# EAGLE schematic eDNA-SingleBoard-V3 (EAGLE 9.6.2)

## Sheet 1 of 2: Logic + Sensor
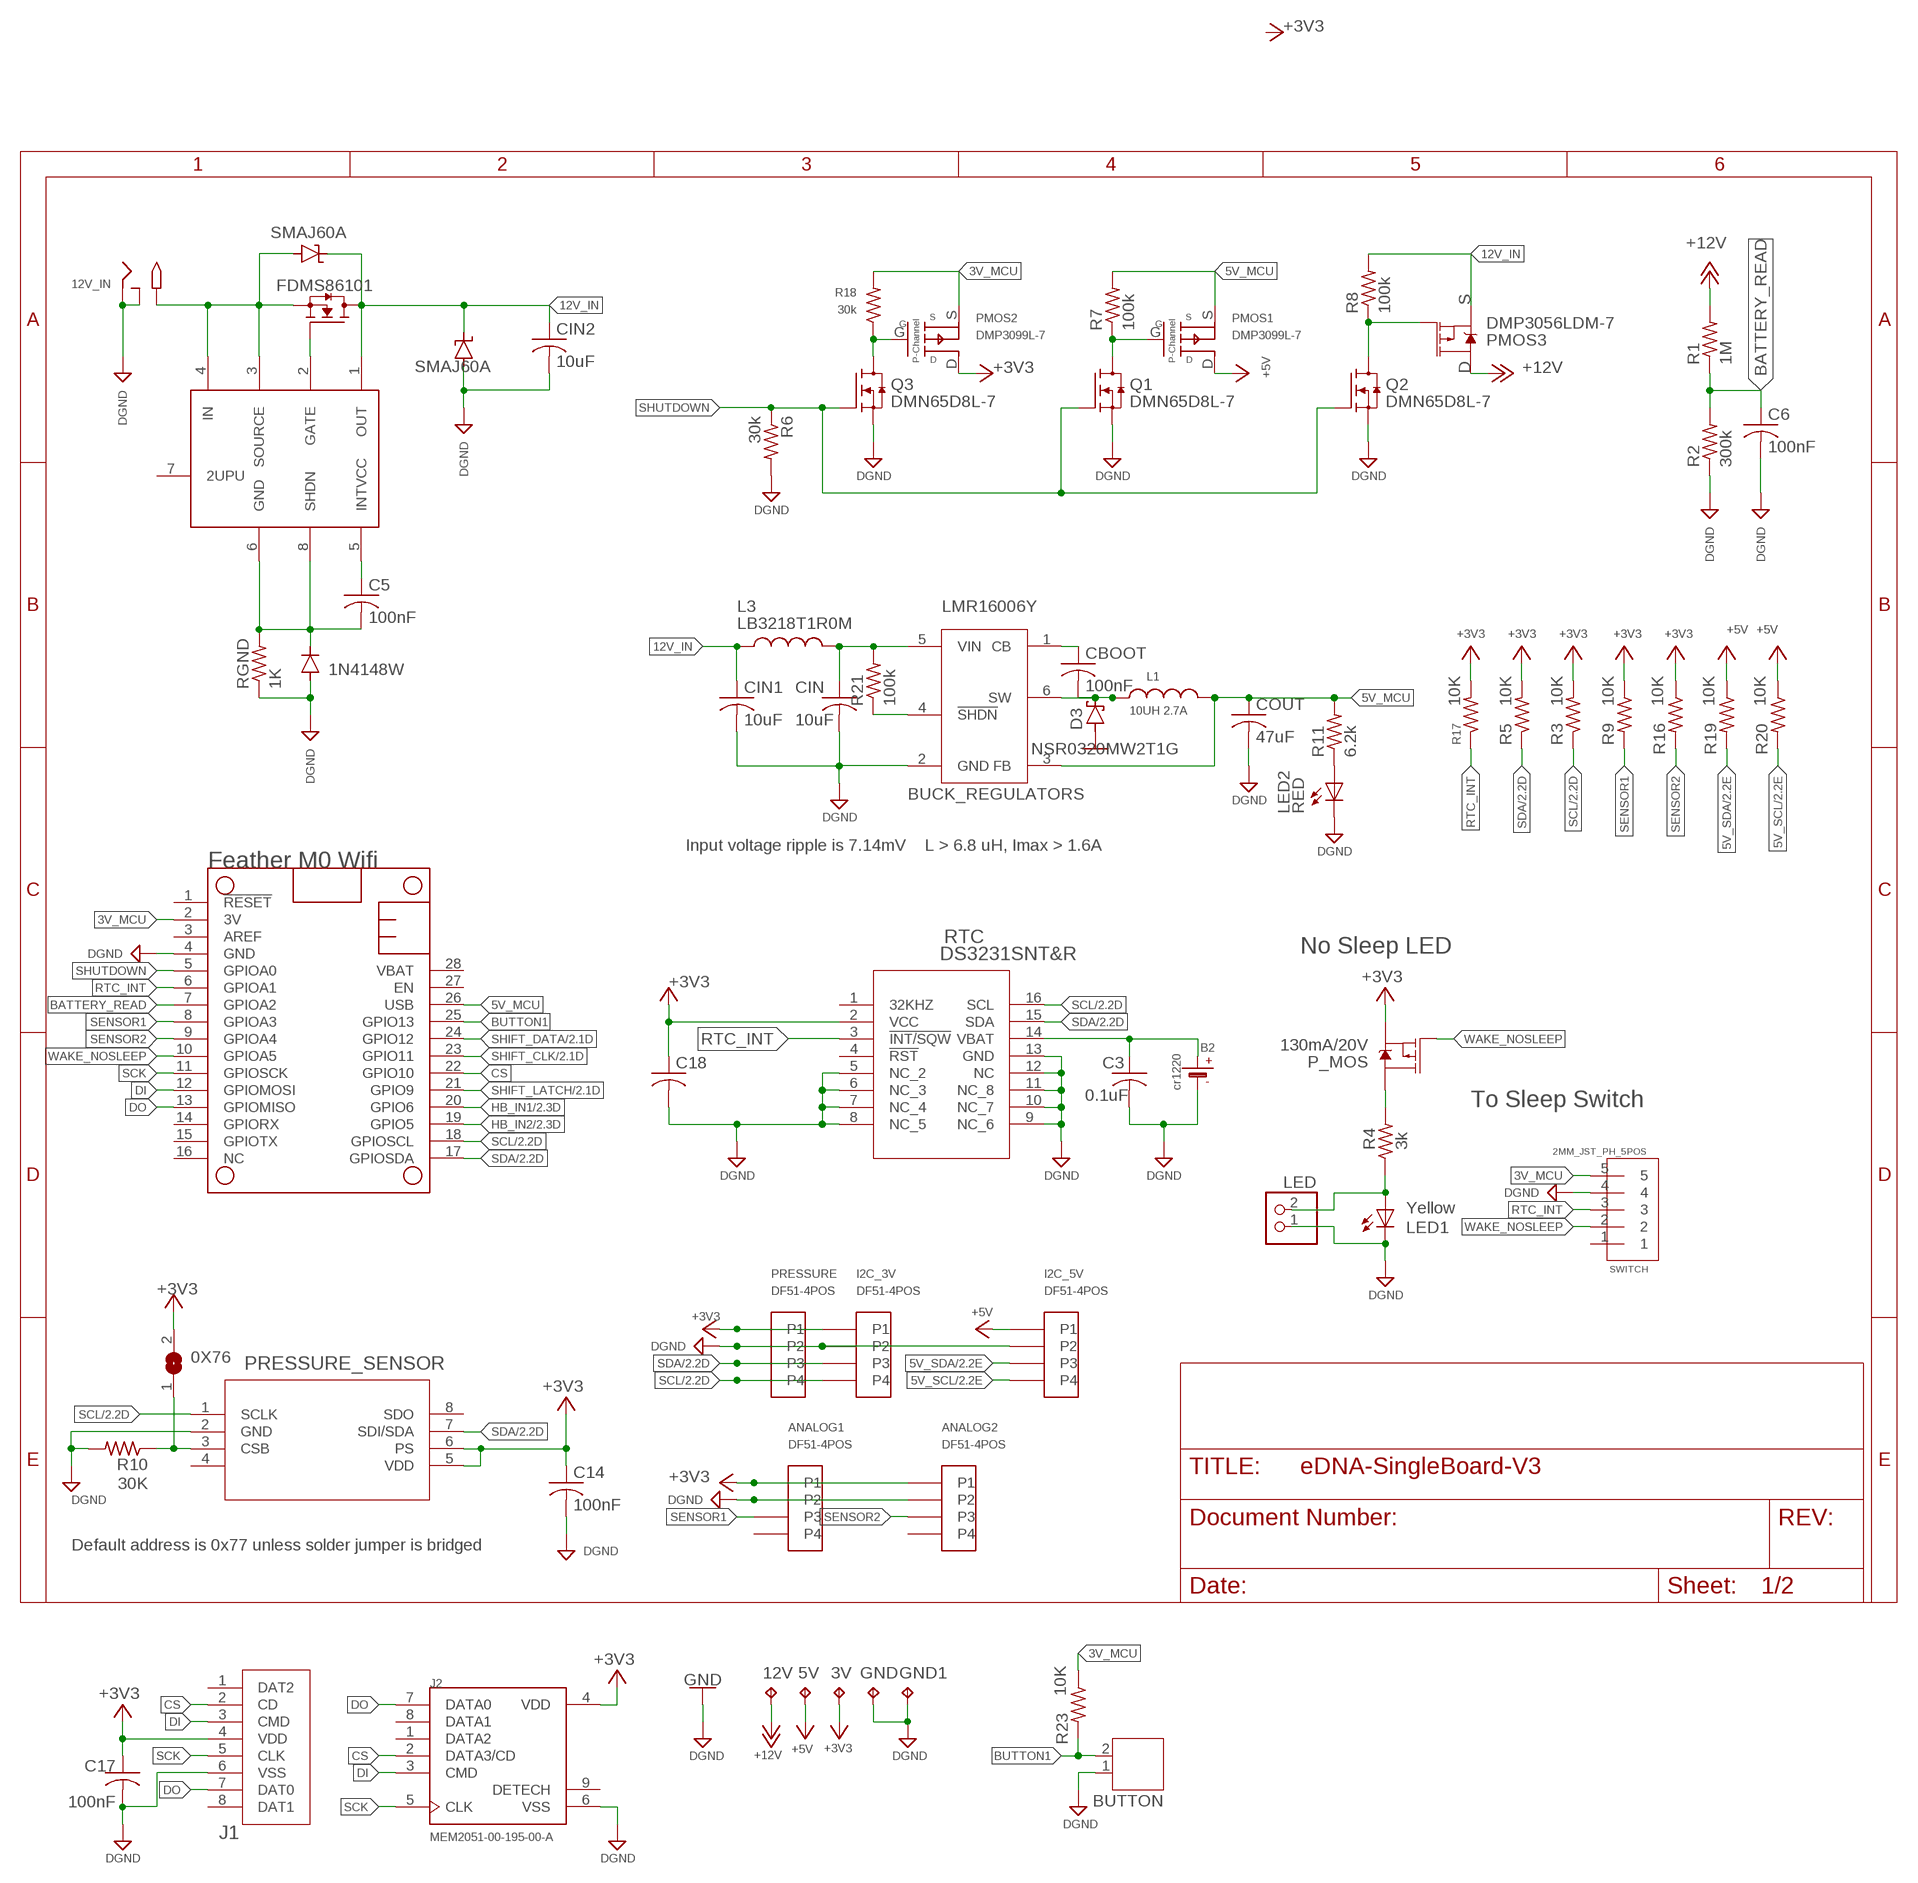
[diagram p0: schematic, sheet 1]

### Parts
0X76  SJ  [SJ]
3V  TPPAD1-13  [P1-13]
5V  TPPAD1-13  [P1-13]
12V  TPPAD1-13  [P1-13]
12V_IN  2.1MMJACKSMT  [DCJACK_2MM_SMT]
ANALOG1  DF51-4POS  [DF51-4POS]
ANALOG2  DF51-4POS  [DF51-4POS]
B2  cr1220  BATTERYCR1220_2  [CR1220-2]
BUTTON  JST-PH2  [JST-PH2]
C3  0.1uF  C-USC0805  [C0805]
C5  100nF  C-USC0805  [C0805]
C6  100nF  C-USC0805  [C0805]
C14  100nF  C-USC0805  [C0805]
C17  100nF  C-USC0805  [C0805]
C18  100nF  C-USC0805  [C0805]
CBOOT  100nF  C-USC0805  [C0805]
CIN  10uF  C-USC0805  [C0805]
CIN1  10uF  C-USC0805  [C0805]
CIN2  10uF  C-USC0805  [C0805]
COUT  47uF  C-USC0805  [C0805]
D2  1N4148W  [SOD-123_MINI-SMA]
D3  NSR0320MW2T1G  BAT60J  [SOD323_ST]
D4  SMAJ60A  [DO_214]
D5  SMAJ60A  [DO_214]
GND  TPPAD1-13  [P1-13]
GND1  TPPAD1-13  [P1-13]
I2C_3V  DF51-4POS  [DF51-4POS]
I2C_5V  DF51-4POS  [DF51-4POS]
J1  PJS008U-3000-0  [CONN_PJS008U-3000-0_YAM]
J2  MEM2051-00-195-00-A  [GCT_MEM2051-00-195-00-A]
L1  10UH 2.7A  WE-MAPI_4030_74438357100  [WE-MAPI_40XX]
L3  LB3218T1R0M  [INDC3218X200N]
LED  2.5MM_JST_UP_2POS  [JST_2POS_2.5MM_UP]
LED1  Yellow  LEDCHIPLED_0805  [CHIPLED_0805]
LED2  RED  LEDCHIPLED_0805  [CHIPLED_0805]
MS1  FEATHERWING  [FEATHERWING]
NMOS  FDMS86101  [8-POWERTDFN]
P_MOS  130mA/20V  MOSFET_PCH-IRLML2244  [SOT23-3]
PMOS1  DMP3099L-7  SSM3J3228R  [SOT-23-3]
PMOS2  DMP3099L-7  SSM3J3228R  [SOT-23-3]
PMOS3  DMP3056LDM-7  P-MOSFET  [SOT23-6]
PRESSURE  DF51-4POS  [DF51-4POS]
PRESSURE_SENSOR  MS580302BA01-00  [MS5803-02BA01]
Q1  DMN65D8L-7  NMOS  [SOT23-S]
Q2  DMN65D8L-7  NMOS  [SOT23-S]
Q3  DMN65D8L-7  NMOS  [SOT23-S]
R1  1M  R-US_R0805  [R0805]
R2  300k  R-US_R0805  [R0805]
R3  10K  R-US_R0805  [R0805]
R4  3k  R-US_R0805  [R0805]
R5  10K  R-US_R0805  [R0805]
R6  30k  WSLP1206R0500FEA  [RES_1206]
R7  100k  WSLP1206R0500FEA  [RES_1206]
R8  100k  WSLP1206R0500FEA  [RES_1206]
R9  10K  R-US_R0805  [R0805]
R10  30K  R-US_R0805  [R0805]
R11  6.2k  R-US_R0805  [R0805]
R16  10K  R-US_R0805  [R0805]
R17  10K  R-US_R0805  [R0805]
R18  30k  WSLP1206R0500FEA  [RES_1206]
R19  10K  R-US_R0805  [R0805]
R20  10K  R-US_R0805  [R0805]
R21  100k  WSLP1206R0500FEA  [RES_1206]
R23  10K  R-US_R0805  [R0805]
RGND  1K  R-US_R0805  [R0805]
RTC  DS3231SNT&R  [21-0042B_16]
SWITCH  2MM_JST_PH_5POS  [2MM_5POS_HEADER]
U$7  LTC4372  [SOP65P640X120-8N]
VREG  BUCK_REGULATORS  [SOT23-6@1]

### Nets
3V_MCU: MS1.2(3V) PMOS2.S R18.2 R23.1 SWITCH.5
5V_MCU: COUT.1 L1.2 MS1.26(USB) PMOS1.S R7.2 R11.2 VREG.3(FB)
5V_SCL: I2C_5V.P$4(P4) R20.2 ; also sheet 2
5V_SDA: I2C_5V.P$3(P3) R19.2 ; also sheet 2
12V_IN: CIN1.1 CIN2.1 D4.C D5.C L3.1 NMOS.5(D) NMOS.6(D) NMOS.7(D) NMOS.8(D) NMOS.9(D) PMOS3.4(S) R8.2 U$7.1(OUT)
+3V3: 0X76.2 3V.TP ANALOG1.P$1(P1) ANALOG2.P$1(P1) C14.1 C17.1 C18.1 I2C_3V.P$1(P1) J1.4(VDD) J2.4(VDD) P_MOS.2(S) PMOS2.D PRESSURE.P$1(P1) PRESSURE_SENSOR.5(VDD) PRESSURE_SENSOR.6(PS) R3.2 R5.2 R9.1 R16.1 R17.2 RTC.2(VCC) ; also sheet 2
+5V: 5V.TP I2C_5V.P$1(P1) PMOS1.D R19.1 R20.1 ; also sheet 2
+12V [12v]: 12V.TP PMOS3.1(D) PMOS3.2(D) PMOS3.5(D) PMOS3.6(D) R1.2 ; also sheet 2
+12V_NON_PROTECT: 12V_IN.PWR2(TIP) D5.A NMOS.1(S) NMOS.2(S) NMOS.3(S) U$7.3(SOURCE) U$7.4(IN)
BATTERY_READ: C6.1 MS1.7(GPIOA2) R1.1 R2.2
BUTTON1: BUTTON.2 MS1.25(GPIO13) R23.2
CS: J1.2(CD) J2.2(DATA3/CD) MS1.22(GPIO10)
DGND: 12V_IN.GND(RING) 12V_IN.GNDBREAK(RING_SW) ANALOG1.P$2(P2) ANALOG2.P$2(P2) B2.- BUTTON.1 C3.2 C6.2 C14.2 C17.2 C18.2 CIN1.2 CIN2.2 CIN.2 COUT.2 D2.A D4.A GND1.TP GND.TP I2C_3V.P$2(P2) I2C_5V.P$2(P2) J1.6(VSS) J2.6(VSS) LED1.C LED2.C LED.1 MS1.4(GND) PRESSURE.P$2(P2) PRESSURE_SENSOR.2(GND) Q1.2(S) Q2.2(S) Q3.2(S) R2.1 R6.2 R10.2 RGND.1 RTC.5(NC_2) RTC.6(NC_3) RTC.7(NC_4) RTC.8(NC_5) RTC.9(NC_6) RTC.10(NC_7) RTC.11(NC_8) RTC.12(NC) RTC.13(GND) SWITCH.4 VREG.2(GND) ; supply symbol labelled GND ; also sheet 2
DI: J1.3(CMD) J2.3(CMD) MS1.12(GPIOMOSI)
DO: J1.7(DAT0) J2.7(DATA0) MS1.13(GPIOMISO)
GND: D3.A
HB_IN1: MS1.20(GPIO6) ; also sheet 2
HB_IN2: MS1.19(GPIO5) ; also sheet 2
N$1: B2.+ C3.1 RTC.14(VBAT)
N$2: P_MOS.3(D) R4.2
N$3: PMOS3.3(G) Q2.3(D) R8.1
N$6: 0X76.1 PRESSURE_SENSOR.3(CSB) R10.1
N$8: NMOS.4(G) U$7.2(GATE)
N$9: LED1.A LED.2 R4.1
N$10: PMOS1.G Q1.3(D) R7.1
N$11: LED2.A R11.1
N$12: R21.1 VREG.4(!SHDN)
N$13: PMOS2.G Q3.3(D) R18.1
N$15: CIN.1 L3.2 R21.2 VREG.5(VIN)
N$16: CBOOT.1 VREG.1(CB)
N$17: CBOOT.2 D3.C L1.1 VREG.6(SW)
N$18: C5.1 U$7.5(INTVCC)
N$19: C5.2 D2.C RGND.2 U$7.6(GND) U$7.8(SHDN)
RTC_INT: MS1.6(GPIOA1) R17.1 RTC.3(!INT/SQW) SWITCH.3
SCK: J1.5(CLK) J2.5(CLK) MS1.11(GPIOSCK)
SCL: I2C_3V.P$4(P4) MS1.18(GPIOSCL) PRESSURE.P$4(P4) PRESSURE_SENSOR.1(SCLK) R3.1 RTC.16(SCL) ; also sheet 2
SDA: I2C_3V.P$3(P3) MS1.17(GPIOSDA) PRESSURE.P$3(P3) PRESSURE_SENSOR.7(SDI/SDA) R5.1 RTC.15(SDA) ; also sheet 2
SENSOR1: ANALOG1.P$3(P3) MS1.8(GPIOA3) R9.2
SENSOR2: ANALOG2.P$3(P3) MS1.9(GPIOA4) R16.2
SHIFT_CLK: MS1.23(GPIO11) ; also sheet 2
SHIFT_DATA: MS1.24(GPIO12) ; also sheet 2
SHIFT_LATCH: MS1.21(GPIO9) ; also sheet 2
SHUTDOWN: MS1.5(GPIOA0) Q1.1(G) Q2.1(G) Q3.1(G) R6.1
WAKE_NOSLEEP: MS1.10(GPIOA5) P_MOS.1(G) SWITCH.2
Unconnected: ANALOG1.P$4(P4) ANALOG2.P$4(P4) J1.1(DAT2) J1.8(DAT1) J2.1(DATA2) J2.8(DATA1) J2.9(DETECH) MS1.1(!RESET) MS1.3(AREF) MS1.14(GPIORX) MS1.15(GPIOTX) MS1.16(NC) MS1.27(EN) MS1.28(VBAT) PRESSURE_SENSOR.4(NC) PRESSURE_SENSOR.8(SDO) RTC.1(32KHZ) RTC.4(!RST) SWITCH.1 U$7.7(2UPU)

### Notes on the sheet
- S
- D
- Input voltage ripple is 7.14mV | L > 6.8 uH, Imax > 1.6A
- Feather M0 Wifi
- No Sleep LED
- To Sleep Switch
- Default address is 0x77 unless solder jumper is bridged

## Sheet 2 of 2: Power
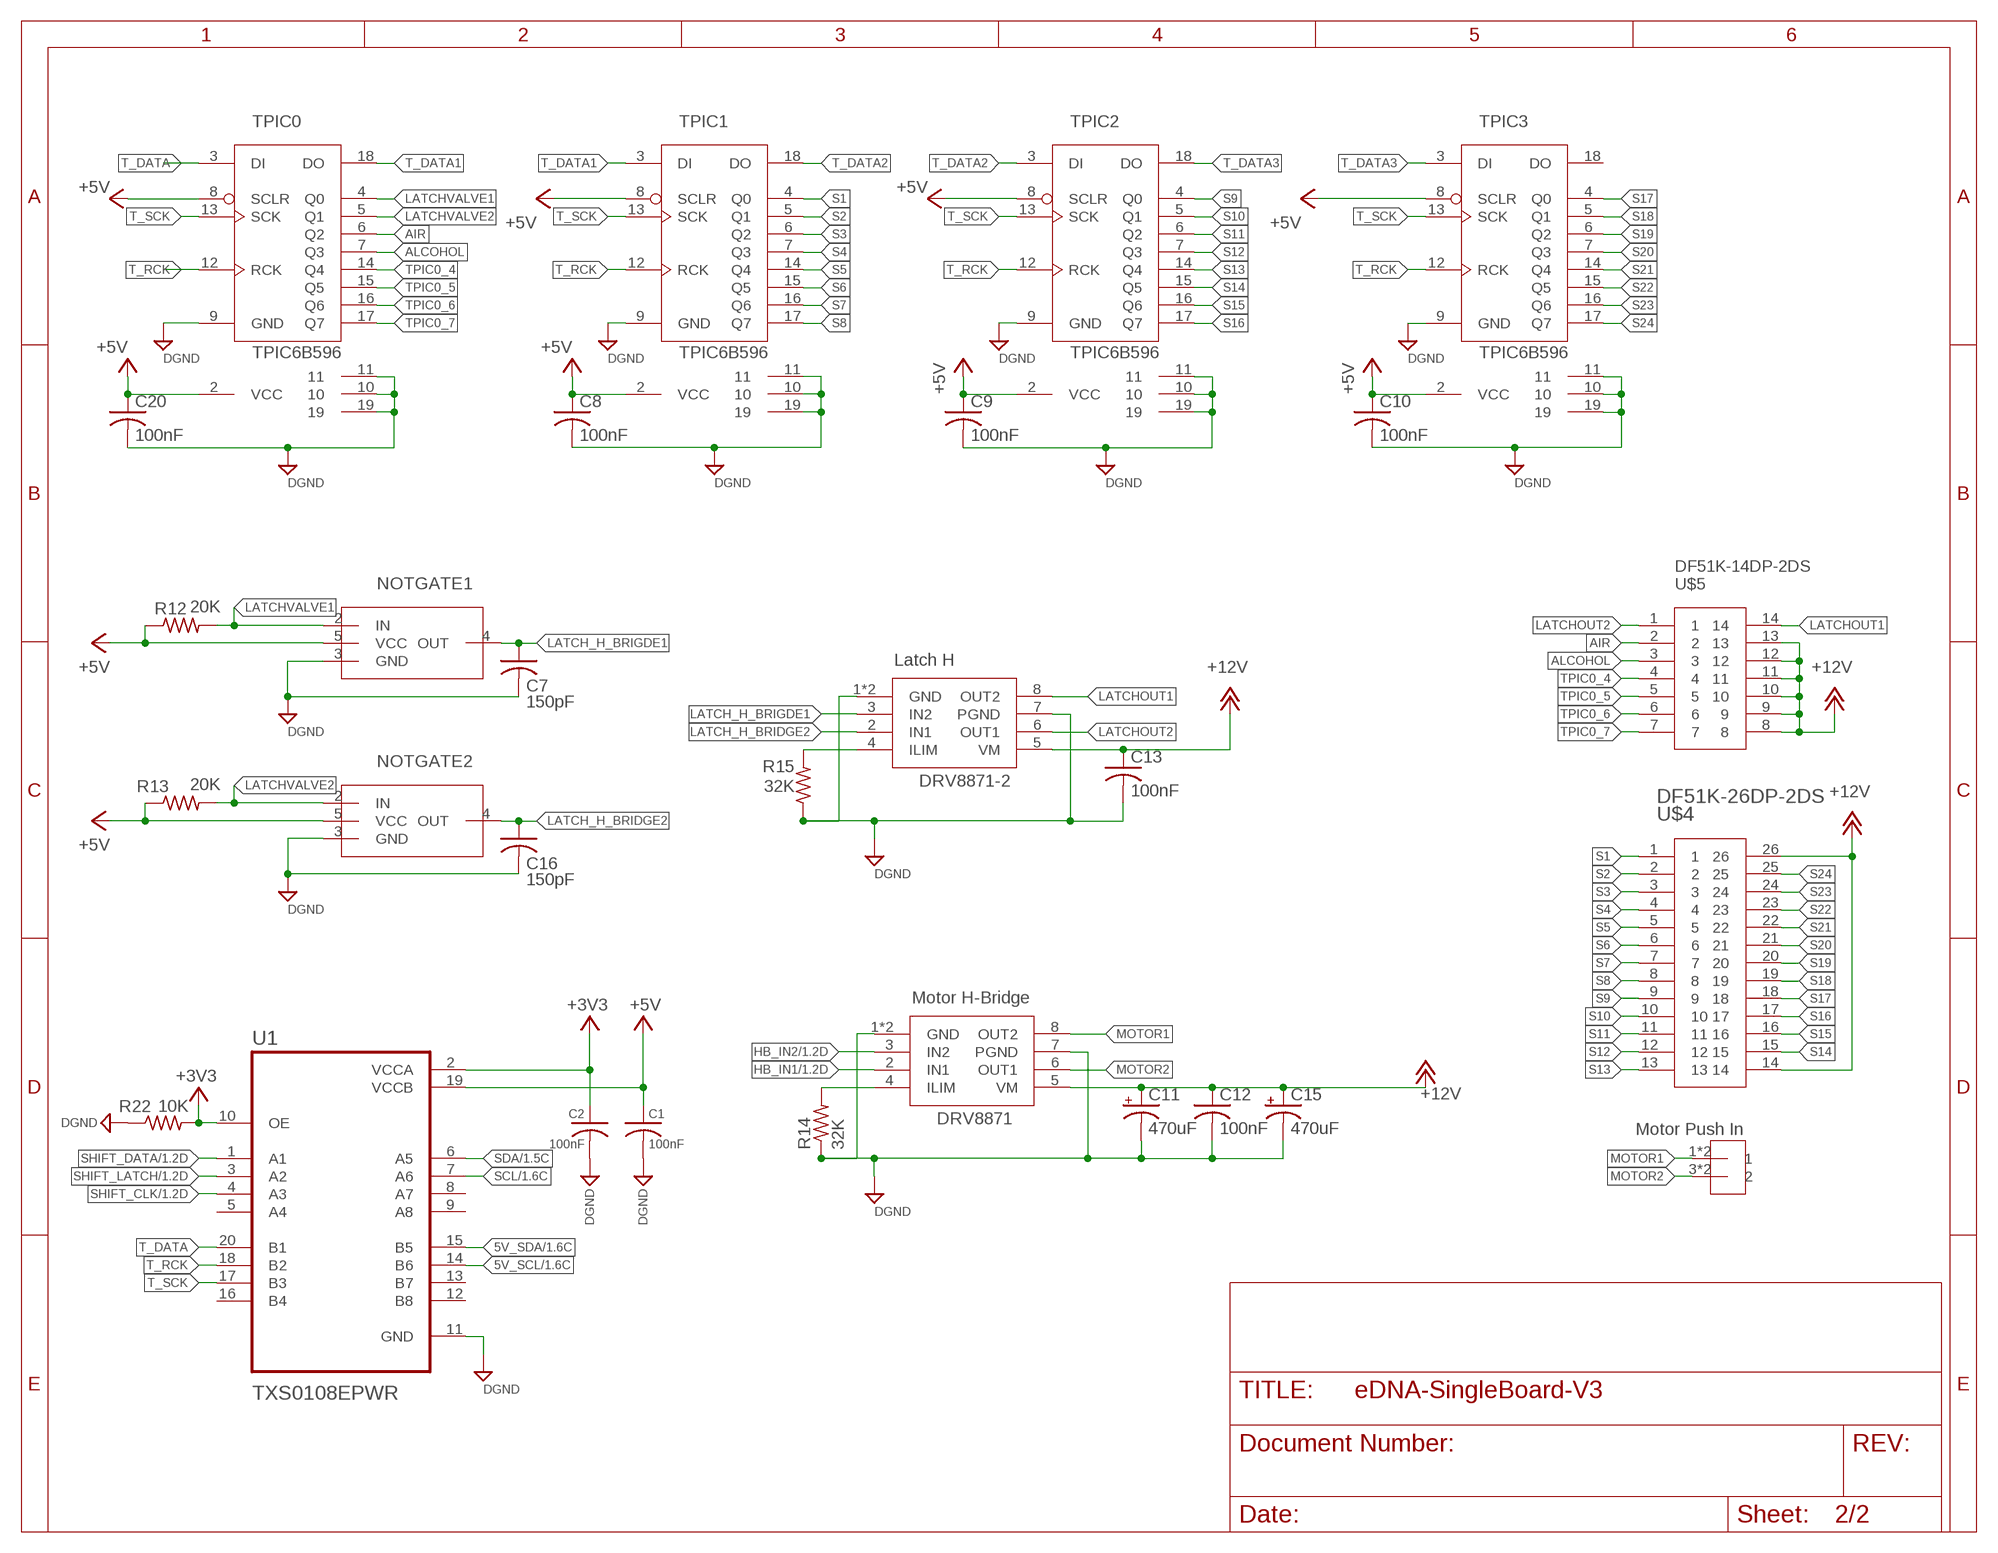
[diagram p1: schematic, sheet 2]

### Parts
C1  100nF  C-USC0805  [C0805]
C2  100nF  C-USC0805  [C0805]
C7  150pF  C-USC0805  [C0805]
C8  100nF  C-USC0805  [C0805]
C9  100nF  C-USC0805  [C0805]
C10  100nF  C-USC0805  [C0805]
C11  470uF  CPOL-US140CLH-0810  [140CLH-0810]
C12  100nF  C-USC0805  [C0805]
C13  100nF  C-USC0805  [C0805]
C15  470uF  CPOL-US140CLH-0810  [140CLH-0810]
C16  150pF  C-USC0805  [C0805]
C20  100nF  C-USC0805  [C0805]
DRV8871  Motor H-Bridge  DRV8871  [SOP8]
DRV8871-2  Latch H  DRV8871  [SOP8]
NOTGATE1  NOT_GATE  [SOT753]
NOTGATE2  NOT_GATE  [SOT753]
R12  20K  R-US_R0805  [R0805]
R13  20K  R-US_R0805  [R0805]
R14  32K  R-US_R0805  [R0805]
R15  32K  R-US_R0805  [R0805]
R22  10K  R-US_R0805  [R0805]
TPIC0  TPIC6B596  [DIP20]
TPIC1  TPIC6B596  [DIP20]
TPIC2  TPIC6B596  [DIP20]
TPIC3  TPIC6B596  [DIP20]
U1  TXS0108EPWR  [SOP65P640X120-20N]
U$2  Motor Push In  PUSH_IN_2  [3.5MM_DIP2]
U$4  DF51K-26DP-2DS  [DF51K-26DP-2DS-ANGLE]
U$5  DF51K-14DP-2DS  [DF51K-14DP-2DS-ANGLE]

### Nets
5V_SCL: U1.14(B6) ; also sheet 1
5V_SDA: U1.15(B5) ; also sheet 1
+3V3: C2.1 R22.2 U1.2(VCCA) U1.10(OE) ; also sheet 1
+5V: C1.1 C8.1 C9.1 C10.1 C20.1 NOTGATE1.5(VCC) NOTGATE2.5(VCC) R12.1 R13.1 TPIC0.2(VCC) TPIC0.8(SCLR) TPIC1.2(VCC) TPIC1.8(SCLR) TPIC2.2(VCC) TPIC2.8(SCLR) TPIC3.2(VCC) TPIC3.8(SCLR) U1.19(VCCB) ; also sheet 1
+12V [12v]: C11.+ C12.1 C13.1 C15.+ DRV8871-2.5(VM) DRV8871.5(VM) U$4.14 U$4.26 U$5.8 U$5.9 U$5.10 U$5.11 U$5.12 U$5.13 ; also sheet 1
AIR: TPIC0.6(Q2) U$5.2
ALCOHOL: TPIC0.7(Q3) U$5.3
DGND: C1.2 C2.2 C7.2 C8.2 C9.2 C10.2 C11.- C12.2 C13.2 C15.- C16.2 C20.2 DRV8871-2.1(GND) DRV8871-2.7(PGND) DRV8871-2.GND DRV8871.1(GND) DRV8871.7(PGND) DRV8871.GND NOTGATE1.3(GND) NOTGATE2.3(GND) R14.1 R15.1 R22.1 TPIC0.9(GND) TPIC0.10 TPIC0.11 TPIC0.19 TPIC1.9(GND) TPIC1.10 TPIC1.11 TPIC1.19 TPIC2.9(GND) TPIC2.10 TPIC2.11 TPIC2.19 TPIC3.9(GND) TPIC3.10 TPIC3.11 TPIC3.19 U1.11(GND) ; also sheet 1
HB_IN1: DRV8871.2(IN1) ; also sheet 1
HB_IN2: DRV8871.3(IN2) ; also sheet 1
LATCH_H_BRIDGE2: C16.1 DRV8871-2.2(IN1) NOTGATE2.4(OUT)
LATCH_H_BRIGDE1: C7.1 DRV8871-2.3(IN2) NOTGATE1.4(OUT)
LATCHOUT1: DRV8871-2.8(OUT2) U$5.14
LATCHOUT2: DRV8871-2.6(OUT1) U$5.1
LATCHVALVE1: NOTGATE1.2(IN) R12.2 TPIC0.4(Q0)
LATCHVALVE2: NOTGATE2.2(IN) R13.2 TPIC0.5(Q1)
MOTOR1: DRV8871.8(OUT2) U$2.1 U$2.2
MOTOR2: DRV8871.6(OUT1) U$2.3 U$2.4
N$4: DRV8871.4(ILIM) R14.2
N$5: DRV8871-2.4(ILIM) R15.2
S1: TPIC1.4(Q0) U$4.1
S2: TPIC1.5(Q1) U$4.2
S3: TPIC1.6(Q2) U$4.3
S4: TPIC1.7(Q3) U$4.4
S5: TPIC1.14(Q4) U$4.5
S6: TPIC1.15(Q5) U$4.6
S7: TPIC1.16(Q6) U$4.7
S8: TPIC1.17(Q7) U$4.8
S9: TPIC2.4(Q0) U$4.9
S10: TPIC2.5(Q1) U$4.10
S11: TPIC2.6(Q2) U$4.11
S12: TPIC2.7(Q3) U$4.12
S13: TPIC2.14(Q4) U$4.13
S14: TPIC2.15(Q5) U$4.15
S15: TPIC2.16(Q6) U$4.16
S16: TPIC2.17(Q7) U$4.17
S17: TPIC3.4(Q0) U$4.18
S18: TPIC3.5(Q1) U$4.19
S19: TPIC3.6(Q2) U$4.20
S20: TPIC3.7(Q3) U$4.21
S21: TPIC3.14(Q4) U$4.22
S22: TPIC3.15(Q5) U$4.23
S23: TPIC3.16(Q6) U$4.24
S24: TPIC3.17(Q7) U$4.25
SCL: U1.7(A6) ; also sheet 1
SDA: U1.6(A5) ; also sheet 1
SHIFT_CLK: U1.4(A3) ; also sheet 1
SHIFT_DATA: U1.1(A1) ; also sheet 1
SHIFT_LATCH: U1.3(A2) ; also sheet 1
T_DATA: TPIC0.3(DI) U1.20(B1)
T_DATA1: TPIC0.18(DO) TPIC1.3(DI)
T_DATA2: TPIC1.18(DO) TPIC2.3(DI)
T_DATA3: TPIC2.18(DO) TPIC3.3(DI)
T_RCK: TPIC0.12(RCK) TPIC1.12(RCK) TPIC2.12(RCK) TPIC3.12(RCK) U1.18(B2)
T_SCK: TPIC0.13(SCK) TPIC1.13(SCK) TPIC2.13(SCK) TPIC3.13(SCK) U1.17(B3)
TPIC0_4: TPIC0.14(Q4) U$5.4
TPIC0_5: TPIC0.15(Q5) U$5.5
TPIC0_6: TPIC0.16(Q6) U$5.6
TPIC0_7: TPIC0.17(Q7) U$5.7
Unconnected: TPIC3.18(DO) U1.5(A4) U1.8(A7) U1.9(A8) U1.12(B8) U1.13(B7) U1.16(B4)

## Library data of the parts
0X76 = jumper:SJ: SMD solder JUMPER
3V 5V 12V GND GND1 = testpad:TP: Test pad
12V_IN = adafruit:2.1MMJACK: 2.1mm x 5.5mm THM DC jack with internal switch. Digikey part #PJ-102A, 4UCON part #05537 2.1mm x 5.5mm SMT DC jack with internal switch. Digikey part #PJ-002A-SMT, 4UCON part #03267 By microbuilder.eu & adafruit.com
ANALOG1 ANALOG2 I2C_3V I2C_5V PRESSURE = HiroseConnectors:DF51-4POS
B2 = microbuilder:BATTERY: CR1220 SMT - Digikey: 3001K-ND CD2032 BAT-HLD-001 - Digikey: BAT-HLD-001-ND
BUTTON = jst-ph:JST-PH2
C1 C2 C5-C10 C12 C13 C16-C18 C20 = resistor:C-US: CAPACITOR, American symbol
C3 C14 = adafruit:C-US: CAPACITOR, American symbol
C11 C15 = adafruit:CPOL-US: POLARIZED CAPACITOR, American symbol
CBOOT CIN CIN1 CIN2 COUT = rcl:C-US: CAPACITOR, American symbol; SPICEPREFIX: C
D2 = Sampler-eDNA:1N4148W
D3 = diode:BAT60J: Schottky barrier diode Source: www.st.com, BAT60J.pdf
D4 D5 = Sampler-eDNA:SMAJ60A
DRV8871 DRV8871-2 = eDNA:DRV8871
J1 = Sampler-eDNA:PJS008U-3000-0; BUILT_BY: EMA_Anthony; COPYRIGHT: Copyright (C) 2018 Accelerated Designs. All rights reserved; MANUFACTURER_PART_NUMBER: PJS008U-3000-0; SOURCELIBRARY: Yamaichi_2019-10-11; VENDOR: Yamaichi
J2 = MEM2051-00-195-00-A:MEM2051-00-195-00-A: Connector, Memory Card, Micro Sd, 8 Position, 1.1mm, Full Reel Check availability <https://pricing.snapeda.com/parts/MEM2051-00-195-00-A/Global%20Connector%20Technology/view-part?ref=eda>; AVAILABILITY: In Stock; DESCRIPTION: 9 (8 + 1) Position Card Connector microSD Surface Mount, Right Angle Gold, 1.95mm profile, Normally open switch, Push push, Top mount; MF: Global Connector Technology; MP: MEM2051-00-195-00-A; PACKAGE: None; PRICE: None; PURCHASE-URL: https://pricing.snapeda.com/search/part/MEM2051-00-195-00-A/?ref=eda
L1 = EMCComponents (rev19e):WE-MAPI_4030: SMD Metal Alloy Power Inductor Characteristics Magnetic iron alloy allows high rated currents Compact design Magnetically shielded High current capability and handles high transient current spikes Low acoustic noise and low leakage flux noise Operating temperature: –40 °C to 125 °C Applications DC/DC-converter for high current power supplies DC/DC-converter for Field Programmable Gate Array (FPGA) POL-converters Portable power like PDA, digital camera Mainboards/graphic cards Battery powered devices Wireless communication devices Power supplies for smartphones, tablet PCs and other mobile devices <http://katalog.we-online.de/media/images/v2/Family_WE-MAPI.jpg> Details see: http://katalog.we-online.de/en/pbs/WE-MAPI? Updated by Dan Xu 2014-07-08 2014 (C) Wurth Elektronik; WE-NUMBER: 74438357100/10uH
L3 = LB3218T1R0M:LB3218T1R0M: INDUCTOR, 1µH, 1.075A, ±20%; Inductance:1µH; Inductance Tolerance:± 20%; DC Resistance Max:60mohm; DC Current Rating:1.075A; Self Resonant Frequency:100MHz; Series:LB; Core Material:Ferrite; Inductor Case Style:SMD; No. of Pins:2 ;RoHS Compliant: No; DESCRIPTION: 1µH Unshielded Wirewound Inductor 1.075A 60mOhm 1207 (3218 Metric); DIGI-KEY_PART_NUMBER: 587-2032-1-ND; MF: Taiyo Yuden; MP: LB3218T1R0M; PACKAGE: 3218 Taiyo Yuden; PURCHASE-URL: https://pricing.snapeda.com/search/part/LB3218T1R0M/?ref=eda
LED = eDNA:2.5MM_JST_UP_2POS
LED1 LED2 = adafruit:LED: LED OSRAM: - CHIPLED LG R971, LG N971, LY N971, LG Q971, LY Q971, LO R971, LY R971 LH N974, LH R974 LS Q976, LO Q976, LY Q976 LO Q996 - Hyper CHIPLED LW Q18S LB Q993, LB Q99A, LB R99A - SideLED LS A670, LO A670, LY A670, LG A670, LP A670 LB A673, LV A673, LT A673, LW A673 LH A674 LY A675 LS A676, LA A676, LO A676, LY A676, LW A676 LS A679, LY A679, LG A679 - Hyper Micro SIDELED® LS Y876, LA Y876, LO Y876, LY Y876 LT Y87S - SmartLED LW L88C, LW L88S LB L89C, LB L89S, LG L890 LS L89K, LO L89K, LY L89K LS L896, LA L896, LO L896, LY L896 - TOPLED LS T670, LO T670, LY T670, LG T670, LP T670 LSG T670, LSP T670, LSY T670, LOP T670, LYG T670 LG T671, LOG T671, LSG T671 LB T673, LV T673, LT T673, LW T673 LH T674 LS T676, LA T676, LO T676, LY T676, LB T676, LH T676, LSB T676, LW T676 LB T67C, LV T67C, LT T67C, LS T67K, LO T67K, LY T67K, LW E67C LS E67B, LA E67B, LO E67B, LY E67B, LB E67C, LV E67C, LT E67C LW T67C LS T679, LY T679, LG T679 LS T770, LO T770, LY T770, LG T770, LP T770 LB T773, LV T773, LT T773, LW T773 LH T774 LS E675, LA E675, LY E675, LS T675 LS T776, LA T776, LO T776, LY T776, LB T776 LHGB T686 LT T68C, LB T68C - Hyper Mini TOPLED® LB M676 - Mini TOPLED Santana® LG M470 LS M47K, LO M47K, LY M47K Source: http://www.osram.convergy.de/
MS1 = adafruit:FEATHERWING
NMOS = Sampler-eDNA:FDMS86101
NOTGATE1 NOTGATE2 = eDNA:NOT_GATE
P_MOS = SparkFun-DiscreteSemi:MOSFET_PCH: P-channel MOSFETs Voltage controlled devices that allow control of high current outputs. SparkFun Products: SparkFun ESP32 Thing <https://www.sparkfun.com/products/13907> SparkFun ESP8266 Thing <https://www.sparkfun.com/products/13231>; PROD_ID: TRANS-11153; VALUE: 4.3A/20V/54mΩ
PMOS1 PMOS2 = M0_Power:SSM3J3228R: PMOS 3.8A (Ta) 1.08W (Ta) Surface Mount SOT-23, 3 pins Source: https://www.digikey.com/en/products/detail/diodes-incorporated/DMP3099L-7/4471075?s=N4IgTCBcDaICIFkAKBmADATgwGQLQHY4BJAYQBVcA5OEAXQF8g Part #: DMP3099L-7DICT-ND; PMOS: P-MOSFET
PMOS3 = eDNA:P-MOSFET: P-Channel 30V 4.3A (Ta) 1.25W (Ta) Surface Mount SOT-26, 6 pins https://www.digikey.com/product-detail/en/diodes-incorporated/DMP3056LDM-7/DMP3056LDMDICT-ND/1964772 Part #: DMP3056LDMDICT-ND
PRESSURE_SENSOR = eDNA:MS580302BA01-00: Pressure sensor https://www.digikey.com/product-detail/en/te-connectivity-measurement-specialties/MS580302BA01-00/223-1624-5-ND/5277629; MANUFACTURER_PART_NUMBER: MS580302BA0100; VENDOR: TE Connectivity
Q1-Q3 = eDNA:NMOS: N-Channel 310mA (Ta) 370mW (Ta) Surface Mount SOT-23, 3 pins https://www.digikey.com/en/products/detail/diodes-incorporated/DMN65D8L-7/3677916 Part #: DMN65D8L-7DICT-ND
R1 R2 R10 R12 R13 R22 = adafruit:R-US_: RESISTOR, American symbol
R3 R5 R9 R14-R17 R19 R20 R23 RGND = rcl:R-US_: RESISTOR, American symbol; SPICEPREFIX: R
R4 R11 = resistor:R-US_: RESISTOR, American symbol
R6-R8 R18 R21 = Resistor_Capacitor:WSLP1206R0500FEA: RES 0.05 OHM 1% 1W 1206 Manufacturer's datasheet <http://www.vishay.com/docs/30122/wslp.pdf>; CREATED_BY: PCBLayout.com; DIGIKEY_PART_NUMBER: WSLP-.05TR-ND; MANUFACTURER: Vishay Dale; MPN: WSLP1206R0500FEA; PACKAGE: SMD 1206
RTC = eDNA:DS3231SNT&R: Real-time clock, RTC, DS3231 https://www.digikey.com/products/en?keywords=DS3231SN%23T%26RCT-ND; MANUFACTURER_PART_NUMBER: DS3231SN#T&R; VENDOR: Maxim Integrated Products
SWITCH = eDNA:2MM_JST_PH_5POS: 5POS JST female, 5 position https://www.digikey.com/product-detail/en/jst-sales-america-inc/B5B-PH-K-S-LF-SN/455-1707-ND/926614
TPIC0 TPIC1-TPIC3 = eDNA:TPIC6B596
U1 = TXS0108EPWR:TXS0108EPWR: Check availability <https://pricing.snapeda.com/parts/TXS0108EPWR/Texas%20Instruments/view-part?ref=eda>; AVAILABILITY: In Stock; DESCRIPTION: 8-bit bidirectional voltage-level shifter for open-drain and push-pull application; MF: Texas Instruments; MP: TXS0108EPWR; PACKAGE: TSSOP-20 Texas Instruments; PRICE: None; PURCHASE-URL: https://pricing.snapeda.com/search/part/TXS0108EPWR/?ref=eda
U$2 = eDNA:PUSH_IN_2: Push in to connect Phoenix Contact - 3.5 mm through hole Can be ordered from : https://www.digikey.com/product-detail/en/phoenix-contact/1864286/277-12184-ND/6605434 OpenSensingLab OSU
U$4 = Sampler-eDNA:DF51K-26DP-2DS
U$5 = Sampler-eDNA:DF51K-14DP-2DS
U$7 = Sampler-eDNA:LTC4372
VREG = eDNA:BUCK_REGULATORS

## Net classes
1 12v: width 0.356 mm, clearance 0.254 mm
2 HIGHVOLTAGE: clearance 0.3 mm
3 sig: width 0.152 mm, clearance 0.2 mm